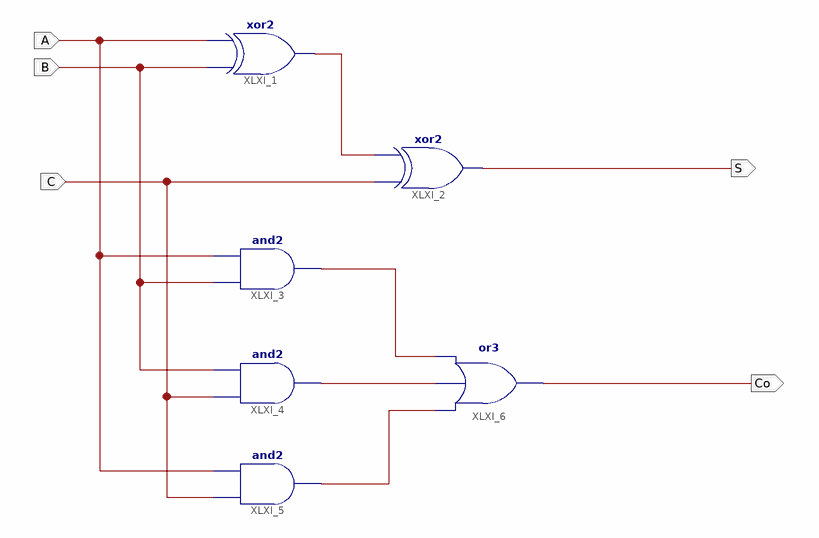
[diagram p0: schematic sheet 1]
// Xilinx ISE schematic Adder1b.sch (kintex7) as structural Verilog: 6 symbols, 5 ports
module Adder1b (
  input  A,
  input  B,
  input  C,
  output Co,
  output S
);

  wire XLXN_3, XLXN_5, XLXN_6, XLXN_7;

  xor XLXI_1 (XLXN_3, B, A);
  xor XLXI_2 (S, C, XLXN_3);
  and XLXI_3 (XLXN_5, B, A);
  and XLXI_4 (XLXN_6, C, B);
  and XLXI_5 (XLXN_7, C, A);
  or XLXI_6 (Co, XLXN_7, XLXN_6, XLXN_5);
endmodule
